# EAGLE schematic axiom_beta_plugin_module_TE0714_SATA_v0.6_r1.2 (EAGLE 7.7.0)
Assembly variants: Beta, Min

## Sheet 1 of 3
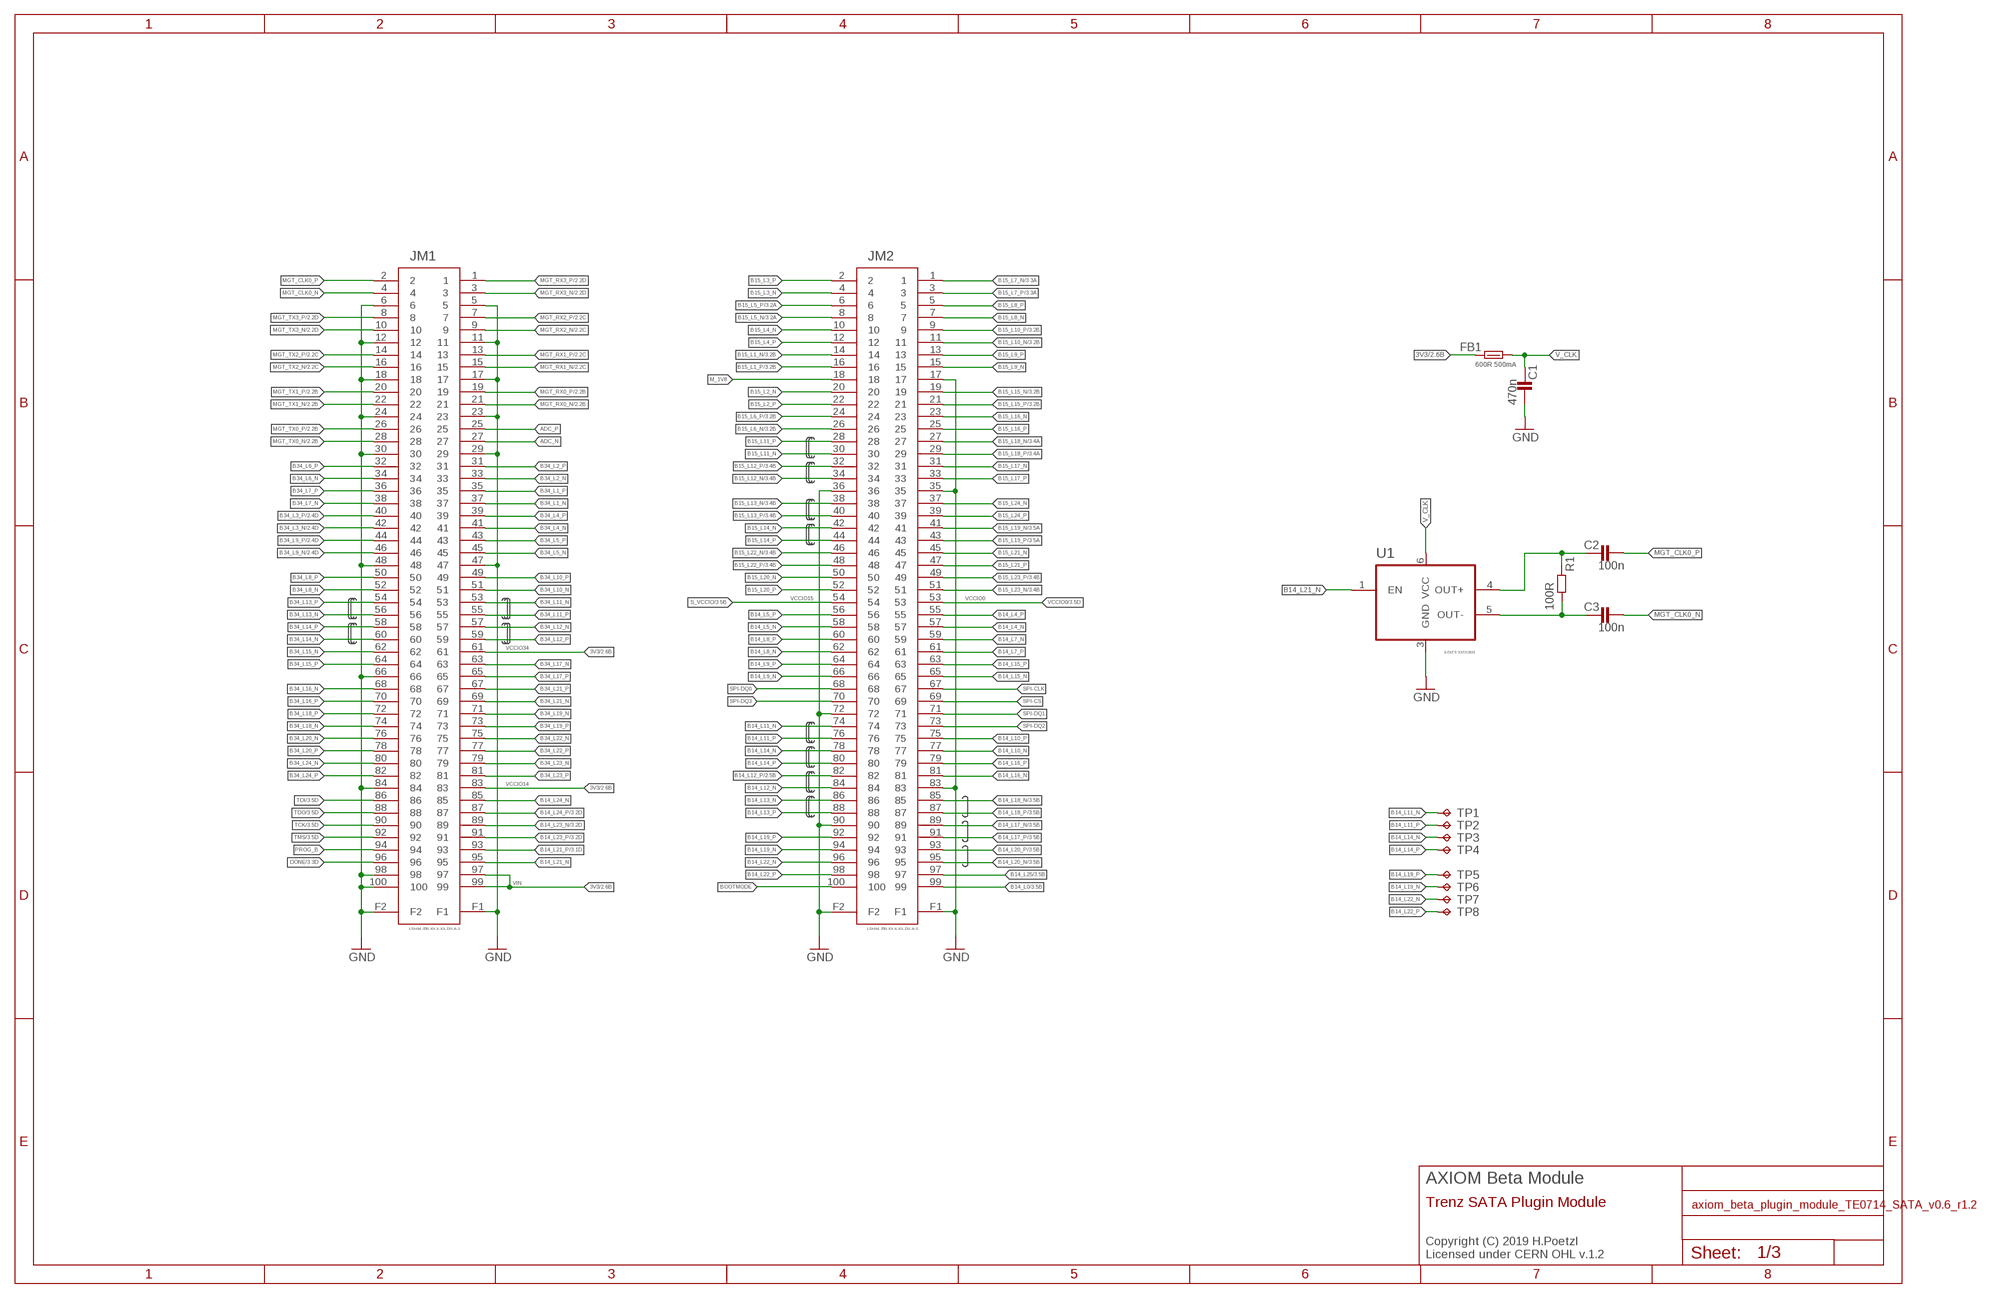
[diagram p0: schematic, sheet 1]

### Parts
C1  470n  C0402-C  [0402-C]
C2  100n  C0201-C  [0201-C]
C3  100n  C0201-C  [0201-C]
FB1  600R 500mA  FB0402-C  [0402-C]
JM1  LSHM-150-XX.X-XX-DV-A-S  [LSHM-150-XX.X-XX-DV-A-S]
JM2  LSHM-150-XX.X-XX-DV-A-S  [LSHM-150-XX.X-XX-DV-A-S]
R1  100R  R0201-C  [0201-C]
TP1  TPTP10R  [TP10R]
TP2  TPTP10R  [TP10R]
TP3  TPTP10R  [TP10R]
TP4  TPTP10R  [TP10R]
TP5  TPTP10R  [TP10R]
TP6  TPTP10R  [TP10R]
TP7  TPTP10R  [TP10R]
TP8  TPTP10R  [TP10R]
U1  DSC11XX-3.2X2.5  [3.2X2.5]

### Nets
3V3 [LVDS]: FB1.1 JM1.61 JM1.83 JM1.97 JM1.99 ; also sheet 2,3
ADC_N: JM1.27
ADC_P: JM1.25
B14_L0: JM2.99 ; also sheet 3
B14_L4_N: JM2.57
B14_L4_P: JM2.55
B14_L5_N: JM2.58
B14_L5_P: JM2.56
B14_L7_N: JM2.59
B14_L7_P: JM2.61
B14_L8_N: JM2.62
B14_L8_P: JM2.60
B14_L9_N: JM2.66
B14_L9_P: JM2.64
B14_L10_N: JM2.77
B14_L10_P: JM2.75
B14_L11_N: JM2.74 TP1.TP
B14_L11_P: JM2.76 TP2.TP
B14_L12_N: JM2.84
B14_L12_P: JM2.82 ; also sheet 2
B14_L13_N: JM2.86
B14_L13_P: JM2.88
B14_L14_N: JM2.78 TP3.TP
B14_L14_P: JM2.80 TP4.TP
B14_L15_N: JM2.65
B14_L15_P: JM2.63
B14_L16_N: JM2.81
B14_L16_P: JM2.79
B14_L17_N: JM2.89 ; also sheet 3
B14_L17_P: JM2.91 ; also sheet 3
B14_L18_N: JM2.85 ; also sheet 3
B14_L18_P: JM2.87 ; also sheet 3
B14_L19_N: JM2.94 TP6.TP
B14_L19_P: JM2.92 TP5.TP
B14_L20_N: JM2.95 ; also sheet 3
B14_L20_P: JM2.93 ; also sheet 3
B14_L21_N: JM1.95 U1.1(EN)
B14_L21_P: JM1.93 ; also sheet 3
B14_L22_N: JM2.96 TP7.TP
B14_L22_P: JM2.98 TP8.TP
B14_L23_N: JM1.89 ; also sheet 3
B14_L23_P: JM1.91 ; also sheet 3
B14_L24_N: JM1.85
B14_L24_P: JM1.87 ; also sheet 3
B14_L25: JM2.97 ; also sheet 3
B15_L1_N [LVDS]: JM2.14 ; also sheet 3
B15_L1_P [LVDS]: JM2.16 ; also sheet 3
B15_L2_N [LVDS]: JM2.20
B15_L2_P [LVDS]: JM2.22
B15_L3_N: JM2.4
B15_L3_P: JM2.2
B15_L4_N: JM2.10
B15_L4_P: JM2.12
B15_L5_N [LVDS]: JM2.8 ; also sheet 3
B15_L5_P [LVDS]: JM2.6 ; also sheet 3
B15_L6_N: JM2.26 ; also sheet 3
B15_L6_P: JM2.24 ; also sheet 3
B15_L7_N [LVDS]: JM2.1 ; also sheet 3
B15_L7_P [LVDS]: JM2.3 ; also sheet 3
B15_L8_N: JM2.7
B15_L8_P: JM2.5
B15_L9_N: JM2.15
B15_L9_P: JM2.13
B15_L10_N [LVDS]: JM2.11 ; also sheet 3
B15_L10_P [LVDS]: JM2.9 ; also sheet 3
B15_L11_N: JM2.30
B15_L11_P: JM2.28
B15_L12_N: JM2.34 ; also sheet 3
B15_L12_P: JM2.32 ; also sheet 3
B15_L13_N: JM2.38 ; also sheet 3
B15_L13_P: JM2.40 ; also sheet 3
B15_L14_N: JM2.42
B15_L14_P: JM2.44
B15_L15_N: JM2.19 ; also sheet 3
B15_L15_P: JM2.21 ; also sheet 3
B15_L16_N: JM2.23
B15_L16_P: JM2.25
B15_L17_N: JM2.31
B15_L17_P: JM2.33
B15_L18_N: JM2.27 ; also sheet 3
B15_L18_P: JM2.29 ; also sheet 3
B15_L19_N: JM2.41 ; also sheet 3
B15_L19_P: JM2.43 ; also sheet 3
B15_L20_N: JM2.50
B15_L20_P: JM2.52
B15_L21_N: JM2.45
B15_L21_P: JM2.47
B15_L22_N: JM2.46 ; also sheet 3
B15_L22_P: JM2.48 ; also sheet 3
B15_L23_N [LVDS]: JM2.51 ; also sheet 3
B15_L23_P [LVDS]: JM2.49 ; also sheet 3
B15_L24_N: JM2.37
B15_L24_P: JM2.39
B34_L1_N: JM1.37
B34_L1_P: JM1.35
B34_L2_N: JM1.33
B34_L2_P: JM1.31
B34_L3_N: JM1.42 ; also sheet 2
B34_L3_P: JM1.40 ; also sheet 2
B34_L4_N: JM1.41
B34_L4_P: JM1.39
B34_L5_N: JM1.45
B34_L5_P: JM1.43
B34_L6_N: JM1.34
B34_L6_P: JM1.32
B34_L7_N: JM1.38
B34_L7_P: JM1.36
B34_L8_N: JM1.52
B34_L8_P: JM1.50
B34_L9_N: JM1.46 ; also sheet 2
B34_L9_P: JM1.44 ; also sheet 2
B34_L10_N: JM1.51
B34_L10_P: JM1.49
B34_L11_N: JM1.53
B34_L11_P: JM1.55
B34_L12_N: JM1.57
B34_L12_P: JM1.59
B34_L13_N: JM1.56
B34_L13_P: JM1.54
B34_L14_N: JM1.60
B34_L14_P: JM1.58
B34_L15_N: JM1.62
B34_L15_P: JM1.64
B34_L16_N: JM1.68
B34_L16_P: JM1.70
B34_L17_N: JM1.63
B34_L17_P: JM1.65
B34_L18_N: JM1.74
B34_L18_P: JM1.72
B34_L19_N: JM1.71
B34_L19_P: JM1.73
B34_L20_N: JM1.76
B34_L20_P: JM1.78
B34_L21_N: JM1.69
B34_L21_P: JM1.67
B34_L22_N: JM1.75
B34_L22_P: JM1.77
B34_L23_N: JM1.79
B34_L23_P: JM1.81
B34_L24_N: JM1.80
B34_L24_P: JM1.82
BOOTMODE: JM2.100
DONE: JM1.96 ; also sheet 3
GND: C1.2 JM1.5 JM1.6 JM1.11 JM1.12 JM1.17 JM1.18 JM1.23 JM1.24 JM1.29 JM1.30 JM1.47 JM1.48 JM1.66 JM1.84 JM1.98 JM1.100 JM1.F1 JM1.F2 JM2.17 JM2.35 JM2.36 JM2.72 JM2.83 JM2.90 JM2.F1 JM2.F2 U1.3(GND) ; also sheet 2,3
M_1V8 [LVDS]: JM2.18
MGT_CLK0_N [LVDS]: C3.2 JM1.4
MGT_CLK0_P [LVDS]: C2.2 JM1.2
MGT_RX0_N [LVDS]: JM1.21 ; also sheet 2
MGT_RX0_P [LVDS]: JM1.19 ; also sheet 2
MGT_RX1_N [LVDS]: JM1.15 ; also sheet 2
MGT_RX1_P [LVDS]: JM1.13 ; also sheet 2
MGT_RX2_N [LVDS]: JM1.9 ; also sheet 2
MGT_RX2_P [LVDS]: JM1.7 ; also sheet 2
MGT_RX3_N [LVDS]: JM1.3 ; also sheet 2
MGT_RX3_P [LVDS]: JM1.1 ; also sheet 2
MGT_TX0_N [LVDS]: JM1.28 ; also sheet 2
MGT_TX0_P [LVDS]: JM1.26 ; also sheet 2
MGT_TX1_N [LVDS]: JM1.22 ; also sheet 2
MGT_TX1_P [LVDS]: JM1.20 ; also sheet 2
MGT_TX2_N [LVDS]: JM1.16 ; also sheet 2
MGT_TX2_P [LVDS]: JM1.14 ; also sheet 2
MGT_TX3_N [LVDS]: JM1.10 ; also sheet 2
MGT_TX3_P [LVDS]: JM1.8 ; also sheet 2
OUT_N: C3.1 R1.2 U1.5(OUT-)
OUT_P: C2.1 R1.1 U1.4(OUT+)
PROG_B: JM1.94
S_VCCIO: JM2.54 ; also sheet 3
SPI-CLK: JM2.67
SPI-CS: JM2.69
SPI-DQ0: JM2.68
SPI-DQ1: JM2.71
SPI-DQ2: JM2.73
SPI-DQ3: JM2.70
TCK: JM1.90 ; also sheet 3
TDI: JM1.86 ; also sheet 3
TDO: JM1.88 ; also sheet 3
TMS: JM1.92 ; also sheet 3
V_CLK: C1.1 FB1.2 U1.6(VCC)
VCCIO0 [LVDS]: JM2.53 ; also sheet 3

### Notes on the sheet
- VCCIO15 | VCCIO0
- VCCIO34
- VCCIO14
- VIN
- AXIOM Beta Module
- Trenz SATA Plugin Module
- Copyright (C) 2019 H.Poetzl
  Licensed under CERN OHL v.1.2

## Sheet 2 of 3
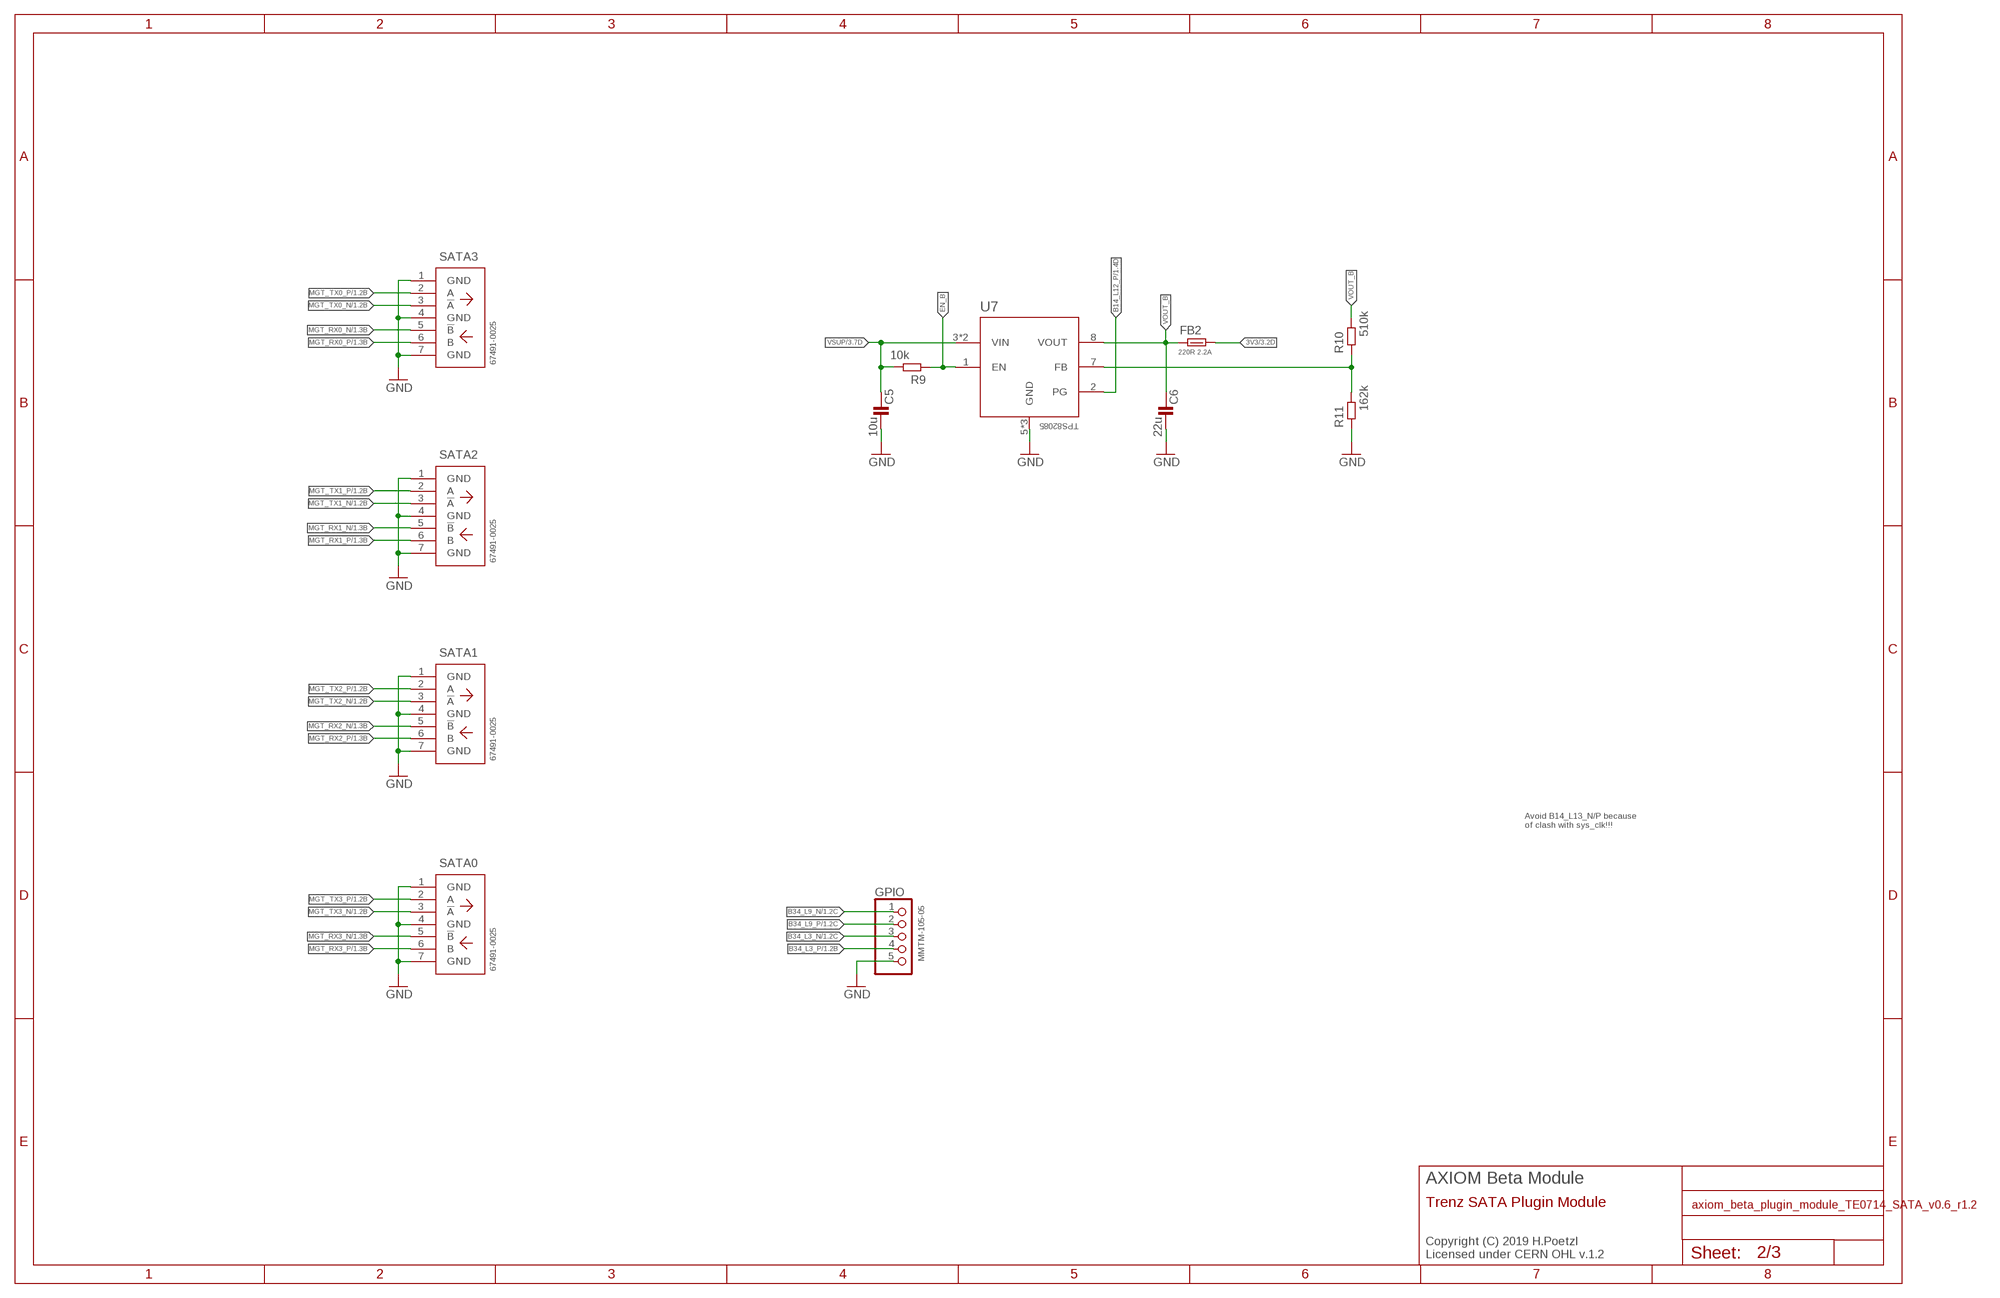
[diagram p1: schematic, sheet 2]

### Parts
C5  10u  C0603-C  [0603-C]
C6  22u  C0603-C  [0603-C]
FB2  220R 2.2A  FB0603-C  [0603-C]
GPIO  MMTM-105-05  PINHD-1X05_2.00  [1X05M]
R9  10k  R0201-C  [0201-C]
R10  510k  R0201-C  [0201-C]
R11  162k  R0201-C  [0201-C]
SATA0  67491-0025  SATA7-VERT-S  [SATA7-VERT-S]
SATA1  67491-0025  SATA7-VERT-S  [SATA7-VERT-S]
SATA2  67491-0025  SATA7-VERT-S  [SATA7-VERT-S]
SATA3  67491-0025  SATA7-VERT-S  [SATA7-VERT-S]
U7  TPS82085  [MICROSIP]

### Nets
3V3 [LVDS]: FB2.2 ; also sheet 1,3
B14_L12_P: U7.2(PG) ; also sheet 1
B34_L3_N: GPIO.3 ; also sheet 1
B34_L3_P: GPIO.4 ; also sheet 1
B34_L9_N: GPIO.1 ; also sheet 1
B34_L9_P: GPIO.2 ; also sheet 1
EN_B: R9.1 U7.1(EN)
FB_B: R10.1 R11.2 U7.7(FB)
GND: C5.2 C6.2 GPIO.5 R11.1 SATA0.1(GND) SATA0.4(GND) SATA0.7(GND) SATA1.1(GND) SATA1.4(GND) SATA1.7(GND) SATA2.1(GND) SATA2.4(GND) SATA2.7(GND) SATA3.1(GND) SATA3.4(GND) SATA3.7(GND) U7.5(GND) U7.6(GND) U7.EP(GND) ; also sheet 1,3
MGT_RX0_N [LVDS]: SATA3.5(!B) ; also sheet 1
MGT_RX0_P [LVDS]: SATA3.6(B) ; also sheet 1
MGT_RX1_N [LVDS]: SATA2.5(!B) ; also sheet 1
MGT_RX1_P [LVDS]: SATA2.6(B) ; also sheet 1
MGT_RX2_N [LVDS]: SATA1.5(!B) ; also sheet 1
MGT_RX2_P [LVDS]: SATA1.6(B) ; also sheet 1
MGT_RX3_N [LVDS]: SATA0.5(!B) ; also sheet 1
MGT_RX3_P [LVDS]: SATA0.6(B) ; also sheet 1
MGT_TX0_N [LVDS]: SATA3.3(!A) ; also sheet 1
MGT_TX0_P [LVDS]: SATA3.2(A) ; also sheet 1
MGT_TX1_N [LVDS]: SATA2.3(!A) ; also sheet 1
MGT_TX1_P [LVDS]: SATA2.2(A) ; also sheet 1
MGT_TX2_N [LVDS]: SATA1.3(!A) ; also sheet 1
MGT_TX2_P [LVDS]: SATA1.2(A) ; also sheet 1
MGT_TX3_N [LVDS]: SATA0.3(!A) ; also sheet 1
MGT_TX3_P [LVDS]: SATA0.2(A) ; also sheet 1
VOUT_B: C6.1 FB2.1 R10.2 U7.8(VOUT)
VSUP [LVDS]: C5.1 R9.2 U7.3(VIN) U7.4(VIN) ; also sheet 3

### Notes on the sheet
- Avoid B14_L13_N/P because
  of clash with sys_clk!!!
- AXIOM Beta Module
- Trenz SATA Plugin Module
- Copyright (C) 2019 H.Poetzl
  Licensed under CERN OHL v.1.2

## Sheet 3 of 3
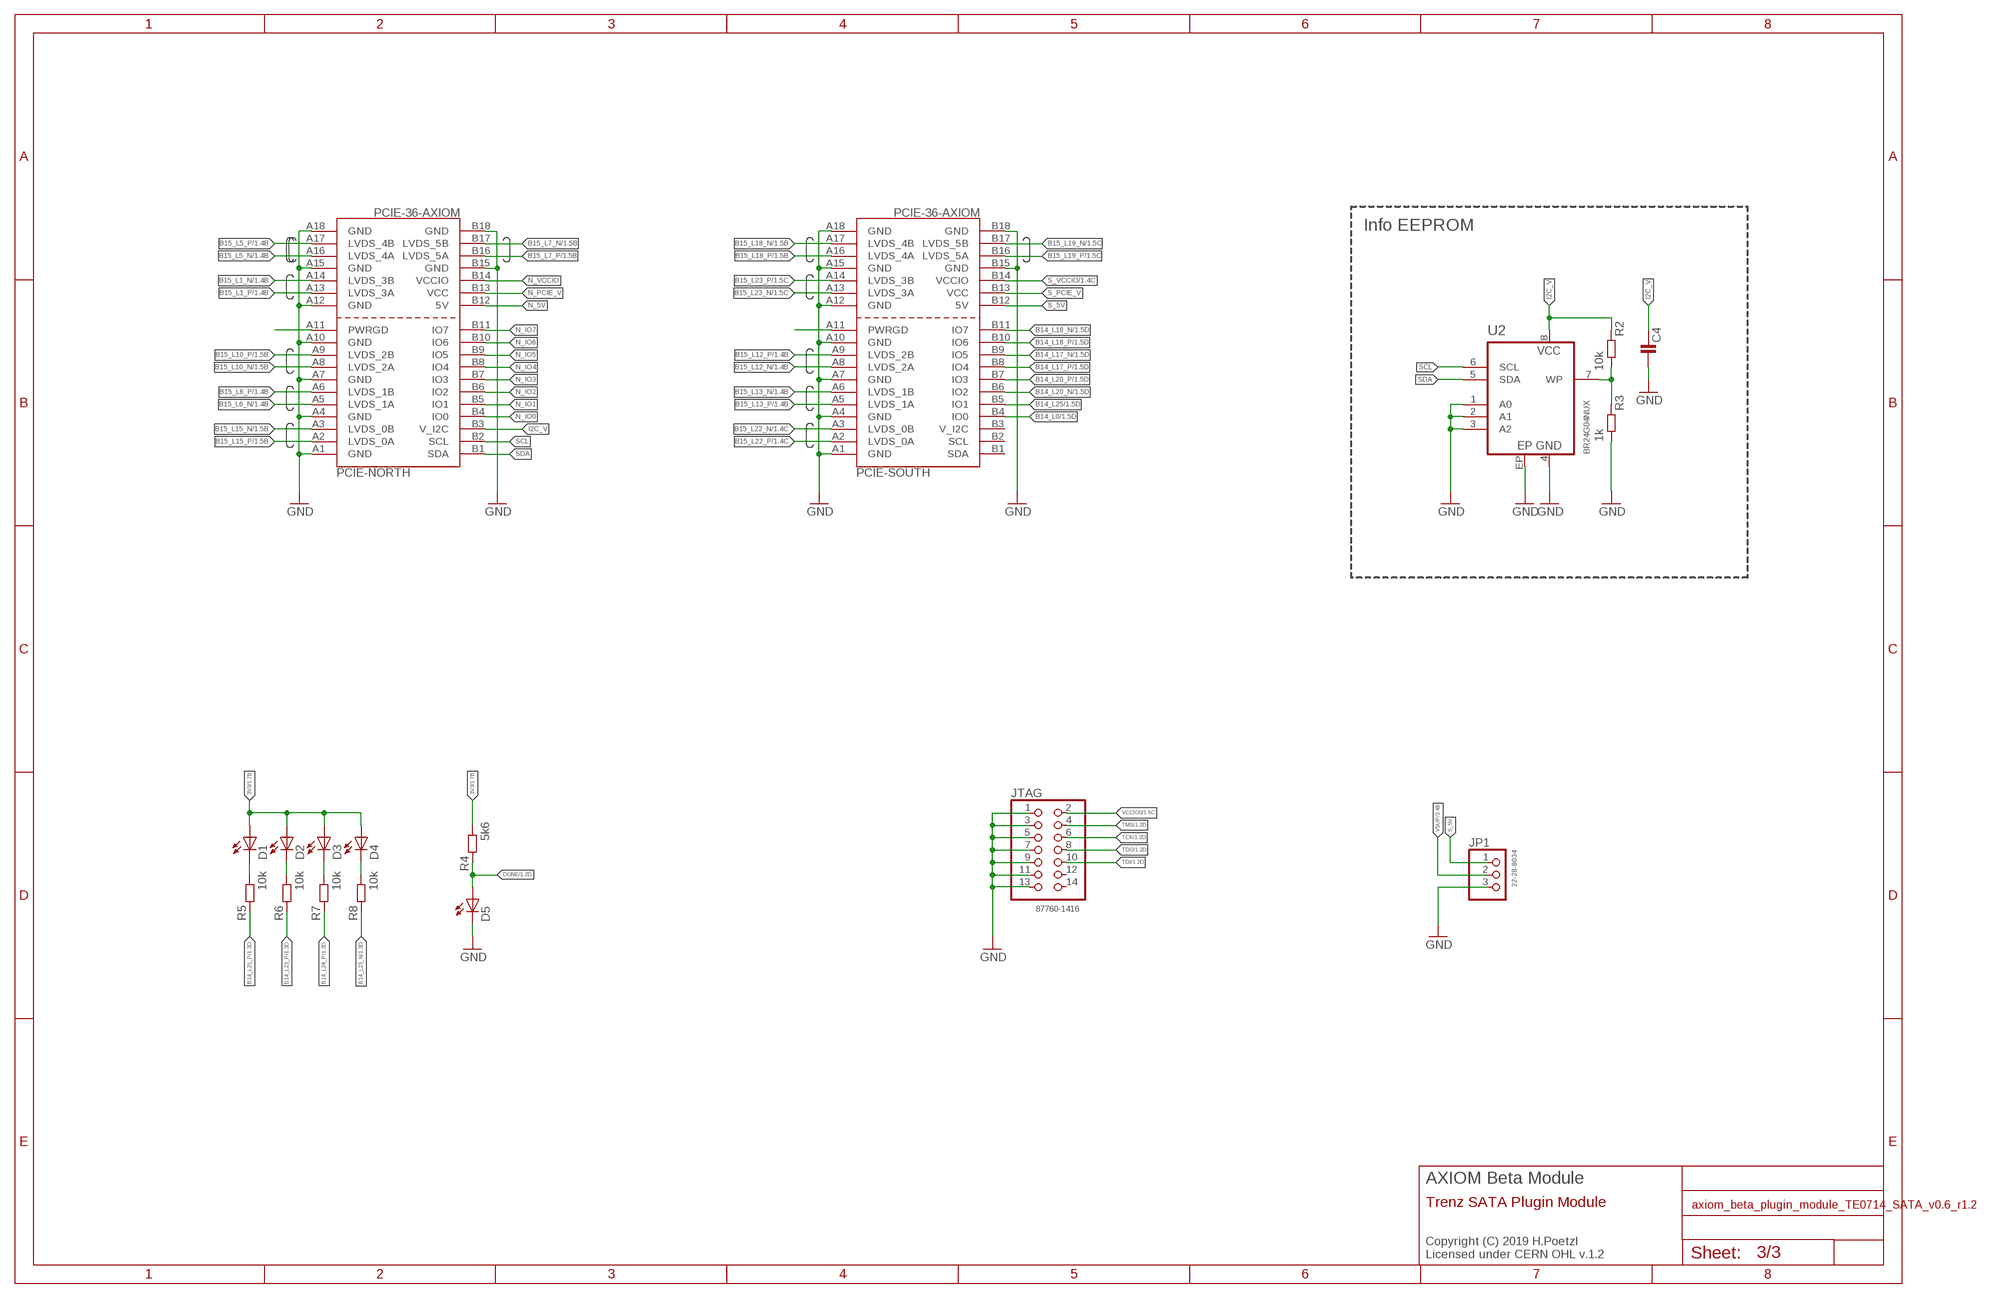
[diagram p2: schematic, sheet 3]

### Parts
C4  C0402-B  [0402-B]
D1  LED  [CHIPLED_0603]
D2  LED  [CHIPLED_0603]
D3  LED  [CHIPLED_0603]
D4  LED  [CHIPLED_0603]
D5  LED  [CHIPLED_0603]
JP1  22-28-8034  PINHD-1X03_2.54-90°-S  [1X03/90-S]
JTAG  87760-1416  PINHD-2X07_2.00  [2X07M]
PCIE-NORTH  PCIE-36-AXIOM  [PCIE-36-AXIOM]  (not fitted in variant Beta)
PCIE-SOUTH  PCIE-36-AXIOM  [PCIE-36-AXIOM]  (not fitted in variant Beta)
R2  10k  R0402-B  [0402-B]
R3  1k  R0402-B  [0402-B]
R4  5k6  R0402-C  [0402-C]
R5  10k  R0402-C  [0402-C]
R6  10k  R0402-C  [0402-C]
R7  10k  R0402-C  [0402-C]
R8  10k  R0402-C  [0402-C]
U2  BR24G04NUX  [DFN200X300X100-9N]

### Nets
3V3 [LVDS]: D1.A D2.A D3.A D4.A R4.2 ; also sheet 1,2
B14_L0: PCIE-SOUTH.B4(IO0) ; also sheet 1
B14_L17_N: PCIE-SOUTH.B9(IO5) ; also sheet 1
B14_L17_P: PCIE-SOUTH.B8(IO4) ; also sheet 1
B14_L18_N: PCIE-SOUTH.B11(IO7) ; also sheet 1
B14_L18_P: PCIE-SOUTH.B10(IO6) ; also sheet 1
B14_L20_N: PCIE-SOUTH.B6(IO2) ; also sheet 1
B14_L20_P: PCIE-SOUTH.B7(IO3) ; also sheet 1
B14_L21_P: R5.1 ; also sheet 1
B14_L23_N: R8.1 ; also sheet 1
B14_L23_P: R6.1 ; also sheet 1
B14_L24_P: R7.1 ; also sheet 1
B14_L25: PCIE-SOUTH.B5(IO1) ; also sheet 1
B15_L1_N [LVDS]: PCIE-NORTH.A14(LVDS_3B) ; also sheet 1
B15_L1_P [LVDS]: PCIE-NORTH.A13(LVDS_3A) ; also sheet 1
B15_L5_N [LVDS]: PCIE-NORTH.A16(LVDS_4A) ; also sheet 1
B15_L5_P [LVDS]: PCIE-NORTH.A17(LVDS_4B) ; also sheet 1
B15_L6_N: PCIE-NORTH.A5(LVDS_1A) ; also sheet 1
B15_L6_P: PCIE-NORTH.A6(LVDS_1B) ; also sheet 1
B15_L7_N [LVDS]: PCIE-NORTH.B17(LVDS_5B) ; also sheet 1
B15_L7_P [LVDS]: PCIE-NORTH.B16(LVDS_5A) ; also sheet 1
B15_L10_N [LVDS]: PCIE-NORTH.A8(LVDS_2A) ; also sheet 1
B15_L10_P [LVDS]: PCIE-NORTH.A9(LVDS_2B) ; also sheet 1
B15_L12_N: PCIE-SOUTH.A8(LVDS_2A) ; also sheet 1
B15_L12_P: PCIE-SOUTH.A9(LVDS_2B) ; also sheet 1
B15_L13_N: PCIE-SOUTH.A6(LVDS_1B) ; also sheet 1
B15_L13_P: PCIE-SOUTH.A5(LVDS_1A) ; also sheet 1
B15_L15_N: PCIE-NORTH.A3(LVDS_0B) ; also sheet 1
B15_L15_P: PCIE-NORTH.A2(LVDS_0A) ; also sheet 1
B15_L18_N: PCIE-SOUTH.A17(LVDS_4B) ; also sheet 1
B15_L18_P: PCIE-SOUTH.A16(LVDS_4A) ; also sheet 1
B15_L19_N: PCIE-SOUTH.B17(LVDS_5B) ; also sheet 1
B15_L19_P: PCIE-SOUTH.B16(LVDS_5A) ; also sheet 1
B15_L22_N: PCIE-SOUTH.A3(LVDS_0B) ; also sheet 1
B15_L22_P: PCIE-SOUTH.A2(LVDS_0A) ; also sheet 1
B15_L23_N [LVDS]: PCIE-SOUTH.A13(LVDS_3A) ; also sheet 1
B15_L23_P [LVDS]: PCIE-SOUTH.A14(LVDS_3B) ; also sheet 1
DONE: D5.A R4.1 ; also sheet 1
GND: C4.2 D5.C JP1.3 JTAG.1 JTAG.3 JTAG.5 JTAG.7 JTAG.9 JTAG.11 JTAG.13 PCIE-NORTH.A1(GND) PCIE-NORTH.A4(GND) PCIE-NORTH.A7(GND) PCIE-NORTH.A10(GND) PCIE-NORTH.A12(GND) PCIE-NORTH.A15(GND) PCIE-NORTH.A18(GND) PCIE-NORTH.B15(GND) PCIE-NORTH.B18(GND) PCIE-SOUTH.A1(GND) PCIE-SOUTH.A4(GND) PCIE-SOUTH.A7(GND) PCIE-SOUTH.A10(GND) PCIE-SOUTH.A12(GND) PCIE-SOUTH.A15(GND) PCIE-SOUTH.A18(GND) PCIE-SOUTH.B15(GND) PCIE-SOUTH.B18(GND) R3.2 U2.1(A0) U2.2(A1) U2.3(A2) U2.4(GND) U2.EP ; also sheet 1,2
I2C_V: C4.1 PCIE-NORTH.B3(V_I2C) R2.1 U2.8(VCC)
N$1 [LVDS]: D1.C R5.2
N$2 [LVDS]: D2.C R6.2
N$3 [LVDS]: D3.C R7.2
N$4 [LVDS]: D4.C R8.2
N$209: PCIE-NORTH.A11(PWRGD)
N$216: R2.2 R3.1 U2.7(WP)
N$256: PCIE-SOUTH.A11(PWRGD)
N_5V: PCIE-NORTH.B12(5V)
N_IO0: PCIE-NORTH.B4(IO0)
N_IO1: PCIE-NORTH.B5(IO1)
N_IO2: PCIE-NORTH.B6(IO2)
N_IO3: PCIE-NORTH.B7(IO3)
N_IO4 [LVDS]: PCIE-NORTH.B8(IO4)
N_IO5 [LVDS]: PCIE-NORTH.B9(IO5)
N_IO6: PCIE-NORTH.B10(IO6)
N_IO7: PCIE-NORTH.B11(IO7)
N_PCIE_V: PCIE-NORTH.B13(VCC)
N_VCCIO: PCIE-NORTH.B14(VCCIO)
S_5V: JP1.1 PCIE-SOUTH.B12(5V)
S_PCIE_V: PCIE-SOUTH.B13(VCC)
S_VCCIO: PCIE-SOUTH.B14(VCCIO) ; also sheet 1
SCL: PCIE-NORTH.B2(SCL) U2.6(SCL)
SDA: PCIE-NORTH.B1(SDA) U2.5(SDA)
TCK: JTAG.6 ; also sheet 1
TDI: JTAG.10 ; also sheet 1
TDO: JTAG.8 ; also sheet 1
TMS: JTAG.4 ; also sheet 1
VCCIO0 [LVDS]: JTAG.2 ; also sheet 1
VSUP [LVDS]: JP1.2 ; also sheet 2
Unconnected: JTAG.12 JTAG.14 PCIE-SOUTH.B1(SDA) PCIE-SOUTH.B2(SCL) PCIE-SOUTH.B3(V_I2C)

### Notes on the sheet
- Info EEPROM
- AXIOM Beta Module
- Trenz SATA Plugin Module
- Copyright (C) 2019 H.Poetzl
  Licensed under CERN OHL v.1.2

## Library data of the parts
C1-C6 = generic-rcl:C
D1-D5 = led:LED
FB1 FB2 = generic-rcl:FB
GPIO = pinhead-2:PINHD-1X05: PIN HEADER
JM1 JM2 = LSHM-150-XX.X-XX-DV-A-S:LSHM-150-XX.X-XX-DV-A-S: 0.5MM TERMINAL/SOCKET COMBO. MANUFACTURER: SAMTEC.
JP1 = pinhead-2:PINHD-1X03: PIN HEADER
JTAG = pinhead-2:PINHD-2X07: PIN HEADER
PCIE-NORTH PCIE-SOUTH = PCIe:PCIE-36-AXIOM
R1-R11 = generic-rcl:R
SATA0 SATA1-SATA3 = sata:SATA7: SATA 7-pin connector From host perspective, A is transmit and B is receive.
TP1-TP8 = testpad:TP: Test pad
U1 = dsc11xx:DSC11XX: DUAL-BIT DUAL-SUPPLY BUS TRANSCEIVER
U2 = eeprom:BR24G04
U7 = TPS82085:TPS82085: Buck/Boost Charge Pump 60mA

## Net classes
0 default: width 0.152 mm, drill 0.203 mm, clearance 0.152 mm
1 LVDS: width 0.152 mm, drill 0.203 mm, clearance 0.152 mm
2 75Ohm: width 0.178 mm, drill 0.203 mm, clearance 0.254 mm
3 MGT: width 0.152 mm, drill 0.203 mm, clearance 0.356 mm